# Altium schematic sheet MCU_Power.SchDoc
size A4; SheetNumber: 1; SheetTotal: 3
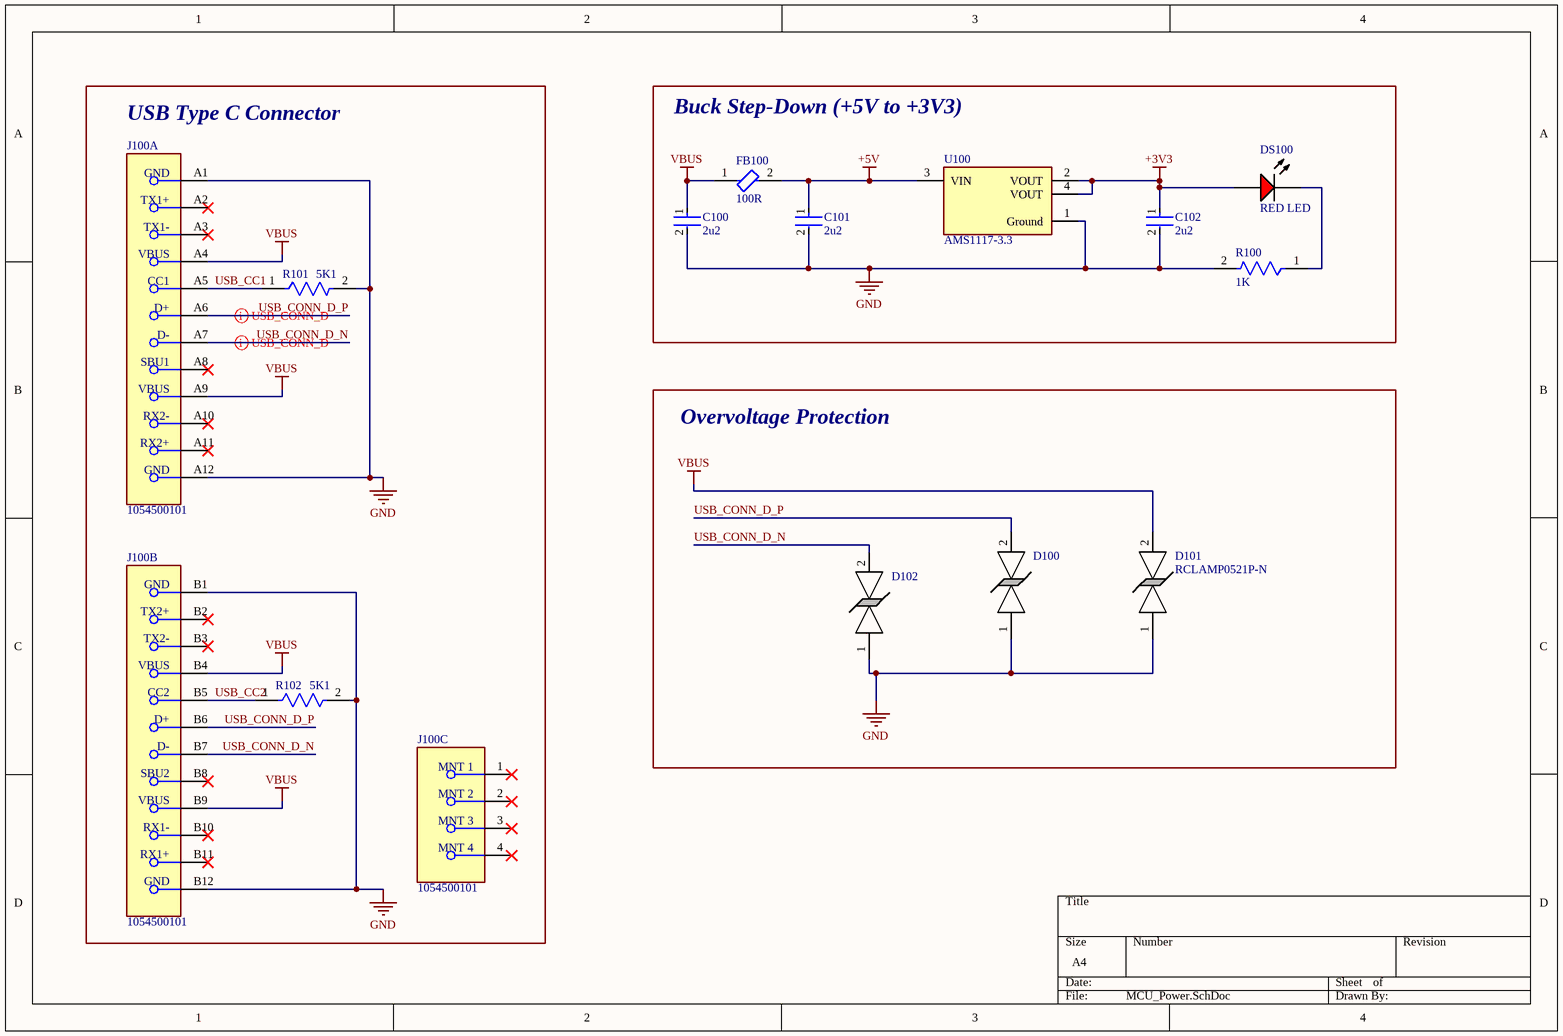
[diagram p0: MCU_Power.SchDoc]

## Parts
C100  2u2  [FP-GRM188-0_1-e0_2_0_5-MFG]
C101  2u2  [FP-GRM188-0_1-e0_2_0_5-MFG]
C102  2u2  [FP-GRM188-0_1-e0_2_0_5-MFG]
D100  RCLAMP0521P-N  [RCLAMP0521P-N]  (value not drawn)
D101  RCLAMP0521P-N  [RCLAMP0521P-N]
D102  RCLAMP0521P-N  [RCLAMP0521P-N]  (value not drawn)
DS100  RED LED  [VISH-TLMX1100_V]
FB100  100R  [FP-BLM18-0_15-t0_5-MFG]
J100  1054500101  [FP-1054500101-MFG]  (parts A,B,C of 3)
R100  1K  [FP-CRCW0603-e3-MFG]
R101  5K1  [FP-CRCW0603-e3-IPC_C]
R102  5K1  [FP-CRCW0603-e3-IPC_C]
U100  AMS1117-3.3  [FP-AMS1117-IPC_C]

## Blocks framed on the sheet
USB Type C Connector: J100 R101 R102
Buck Step-Down (+5V to +3V3): C100-C102 DS100 FB100 R100 U100
Overvoltage Protection: D100-D102

## Nets
+3V3: C102.1 DS100.1(A) U100.2(VOUT) U100.4(VOUT)
+5V: C101.1 FB100.2 U100.3(VIN)
GND: C100.2 C101.2 C102.2 D100.1 D101.1 D102.1 J100.A1(GND) J100.A12(GND) J100.B1(GND) J100.B12(GND) R100.2 R101.2 R102.2 U100.1(Ground)
VBUS: C100.1 D101.2 FB100.1 J100.A4(VBUS) J100.A9(VBUS) J100.B4(VBUS) J100.B9(VBUS)
USB_CC1: J100.A5(CC1) R101.1
USB_CC2: J100.B5(CC2) R102.1
USB_CONN_D_N: D102.2 J100.A7(D-) J100.B7(D-)
USB_CONN_D_P: D100.2 J100.A6(D+) J100.B6(D+)
NetDS100_2: DS100.2(K) R100.1

Not connected (* = marked no-connect by the designer): J100 1(MNT_1)* 2(MNT_2)* 3(MNT_3)* 4(MNT_4)* A2(TX1+)* A3(TX1-)* A8(SBU1)* A10(RX2-)* A11(RX2+)* B2(TX2+)* B3(TX2-)* B8(SBU2)* B10(RX1-)* B11(RX1+)*

## Layout directives
differential pair: USB_CONN_D_N, USB_CONN_D_P

## Library data of the parts
C100-C102 = CMP-2006-02836-2: Chip Multilayer Ceramic Capacitors for General Purpose, 0603, 2.2uF, X7R, 15%, 10%, 10V; Case Code (Metric): 1608; Height: 0.8mm; Packaging: Cut Tape; Voltage: 10V; Lead Free: Lead Free; Min Operating Temperature: -55°C; Voltage Rating (DC): 10V; Max Operating Temperature: 125°C; Voltage Rating: 10V; Dielectric: X7R; Depth: 0.8mm; Case Code (Imperial): 0603; Termination: SMD/SMT; Case/Package: 0603; Number of Pins: 2; REACH SVHC: No SVHC; Mount: Surface Mount; Width: 0.031inch; Material: Ceramic; Capacitance: 2.2uF; Package Quantity: 1; Weight: 7.1E-05oz; Length: 1.6mm; Thickness: 0.035inch; Tolerance: 10%
DS100 = CMP-1666-00027-1: LED, RED, 2.1 V, -40 to 100 degC, 2-Pin SMD (0603), RoHS, Tape and Reel; Type (Capacitors): C0G; Resistance: 100000000000 Ohm; Capacitance: 12 pF; Voltage Rating: 50 V; Tolerance: 5%; Min Operating Temperature: -55degC; REACH SVHC: No SVHC; ComponentLink2Description: Datasheet; ComponentLink1URL: http://www.vishay.com/; Width: 0.8 mm; Package Quantity: 4000; PackageReference: TLMX1100; ComponentLink2URL: http://www.vishay.com/docs/83173/tlmb1100.pdf; Case/Package: 0603; Case Code (Metric): 1608; Packaging: Tape and Reel; Pins: 2; ComponentLink1Description: Manufacturer URL; Max Operating Temperature: 125degC; Height: 0.8 mm; Length: 1.6 mm; Mount: Surface Mount; PackageDescription: 2-Pin Surface Mount Device, Body 1.6 x 0.8 mm; DatasheetVersion: Rev. 2.7, 03/2016; Case Code (Imperial): 0603; Voltage Rating (DC): 50 V; RoHSCompliant: True; Radiation Hardening: No
FB100 = CMP-0686-00530-3: Chip Ferrite Bead, 0603, 100Ω @ 100MHz, 25%, 0.045Ω, 2A; DC Resistance (DCR): 45mR; Number of Circuits: 1; Max Current Rating: 2A; Depth: 0.8mm; Case Code (Imperial): 0603; Tolerance: 25%; Packaging: Tape and Reel; Core Material: Ferrite; Material: Ferrite; Termination: SMD/SMT; Case Code (Metric): 1608; Package Quantity: 1; Length: 1.6mm; Contact Plating: Tin; Lead Free: Lead Free; Impedance: 100R; Max Operating Temperature: 125°C; Height: 0.8mm; Current Rating: 2A; REACH SVHC: No SVHC; Max DC Current: 2A; Min Operating Temperature: -55°C; Case/Package: 0603; Number of Pins: 2; Width: 0.8mm; Test Frequency: 100MHz; Number of Lines: 1
J100 = CMP-04767-000004-1: CONN RCP USB3.1 TYPEC 24P SMD RA; Manufacturer: Molex; Number Of Contacts: 24; Voltage Rating: 30V; Shielding: true; Is Female: yes; Current Rating: 0.25/1.25/5A; Pitch: 0.5mm; Conn Orientation: Right Angle; Package: 0; Height: 3.44mm; Footprint Url: https://www.molex.com/pdm_docs/sd/1054500101_sd.pdf; Device Class L1: Connectors; Category: Conn; Device Class L2: USB Connectors; Digikey Description: CONN RCP USB3.1 TYPEC 24P SMD RA; Contact Material: Gold,Nickel; Mouser Description: USB Shielded I/O Receptacle; Type C; Right Angle; Surface Mount; Gold over Nickel; ComponentLink2Description: Datasheet; Lead Free: Yes; Automotive: No; Temperature Range High: +85°C; RoHS: TRUE; Octopart: https://octopart.com/105450-0101-molex-68082325; ComponentLink2URL: https://www.molex.com/webdocs/datasheets/pdf/en-us/1054500101_IO_CONNECTORS.pdf; Temperature: -30°C to +85°C; Usb Standard: USB 3.1; Temperature Range Low: -30°C; Device Class L3: unset; Manufacturer Part Number: 1054500101
R100 = CMP-1666-00003-5: RES Thick Film, 1kΩ, 1%, 0.1W, 100ppm/°C, 0603; Max Power Dissipation: 100mW; Voltage Rating: 75V; Resistance: 1kR; Max Operating Temperature: 155°C; Number of Pins: 2; Case Code (Imperial): 0603; Width: 0.033inch; Power Rating: 100mW; Number of Terminations: 2; Package Quantity: 10; Weight: 7.1E-05oz; Tolerance: 1%; Temperature Coefficient: 100ppm/°C; Military Standard: Not; Mount: Surface Mount; Voltage Rating (DC): 75V; Depth: 0.85mm; Composition: Thick Film; Radiation Hardening: No; Termination: SMD/SMT; Length: 1.55mm; Case Code (Metric): 1608; Contact Plating: Tin; Min Operating Temperature: -55°C; Packaging: Tape and Reel; Height: 0.45mm; Lead Free: Lead Free; Case/Package: 0603; Features: Automotive AEC-Q200
R101 R102 = CMP-1012-00590-3: RES Thick Film, 5.1kΩ, 1%, 0.1W, 100ppm/°C, 0603; Power Rating: 100mW; Voltage Rating (DC): 75V; Resistance: 5.1kR; Width: 0.85mm; Depth: 0.85mm; Military Standard: Not; Package Quantity: 5000; Case Code (Metric): 1608; Length: 1.55mm; Weight: 7.1E-05oz; Packaging: Tape and Reel; Temperature Coefficient: 100ppm/°C; Case Code (Imperial): 0603; Lead Free: Lead Free; Radiation Hardening: No; Contact Plating: Tin; Composition: Thick Film; Max Operating Temperature: 155°C; Termination: SMD/SMT; Case/Package: 0603; Min Operating Temperature: -55°C; Tolerance: 1%; Voltage Rating: 75V; Mount: Surface Mount; Height: 0.45mm
U100 = CMP-209535-000001-1: LDO Voltage Regulators 1A, 3.3V; Manufacturer: Advanced Monolithic Systems; Dropout Voltage: 1.1V; Output Type: Fixed; Nominal Supply Current: 5mA; Max Power Dissipation: 1.2W; Max Supply Voltage: 15V; Number Of Outputs: 1; Standoff Height: 0.64mm; Max Junction Temp: +125°C; Height: 1.8mm; Package: AMS1117; Device Class L2: Power Management ICs; ComponentLink2Description: Datasheet; ComponentLink2URL: http://www.advanced-monolithic.com/pdf/ds1117.pdf; Category: IC; RoHS: TRUE; Automotive: No; Device Class L1: Integrated Circuits (ICs); Output Current: 1A; Device Class L3: Voltage Regulators - Linear; Temperature: -40°C to +125°C; Output Voltage: 3.3V; Manufacturer Part Number: AMS1117-3.3; Temperature Range Low: -40°C; Octopart: https://octopart.com/ams1117-3.3-advanced+monolithic+systems-25899300; Lead Free: Yes; Ipc Land Pattern Name: SOT229P700X180-4; Temperature Range High: +125°C